# Altium schematic sheet Sheet_1_2023-07-02.schdoc
size 313 x 225 mm
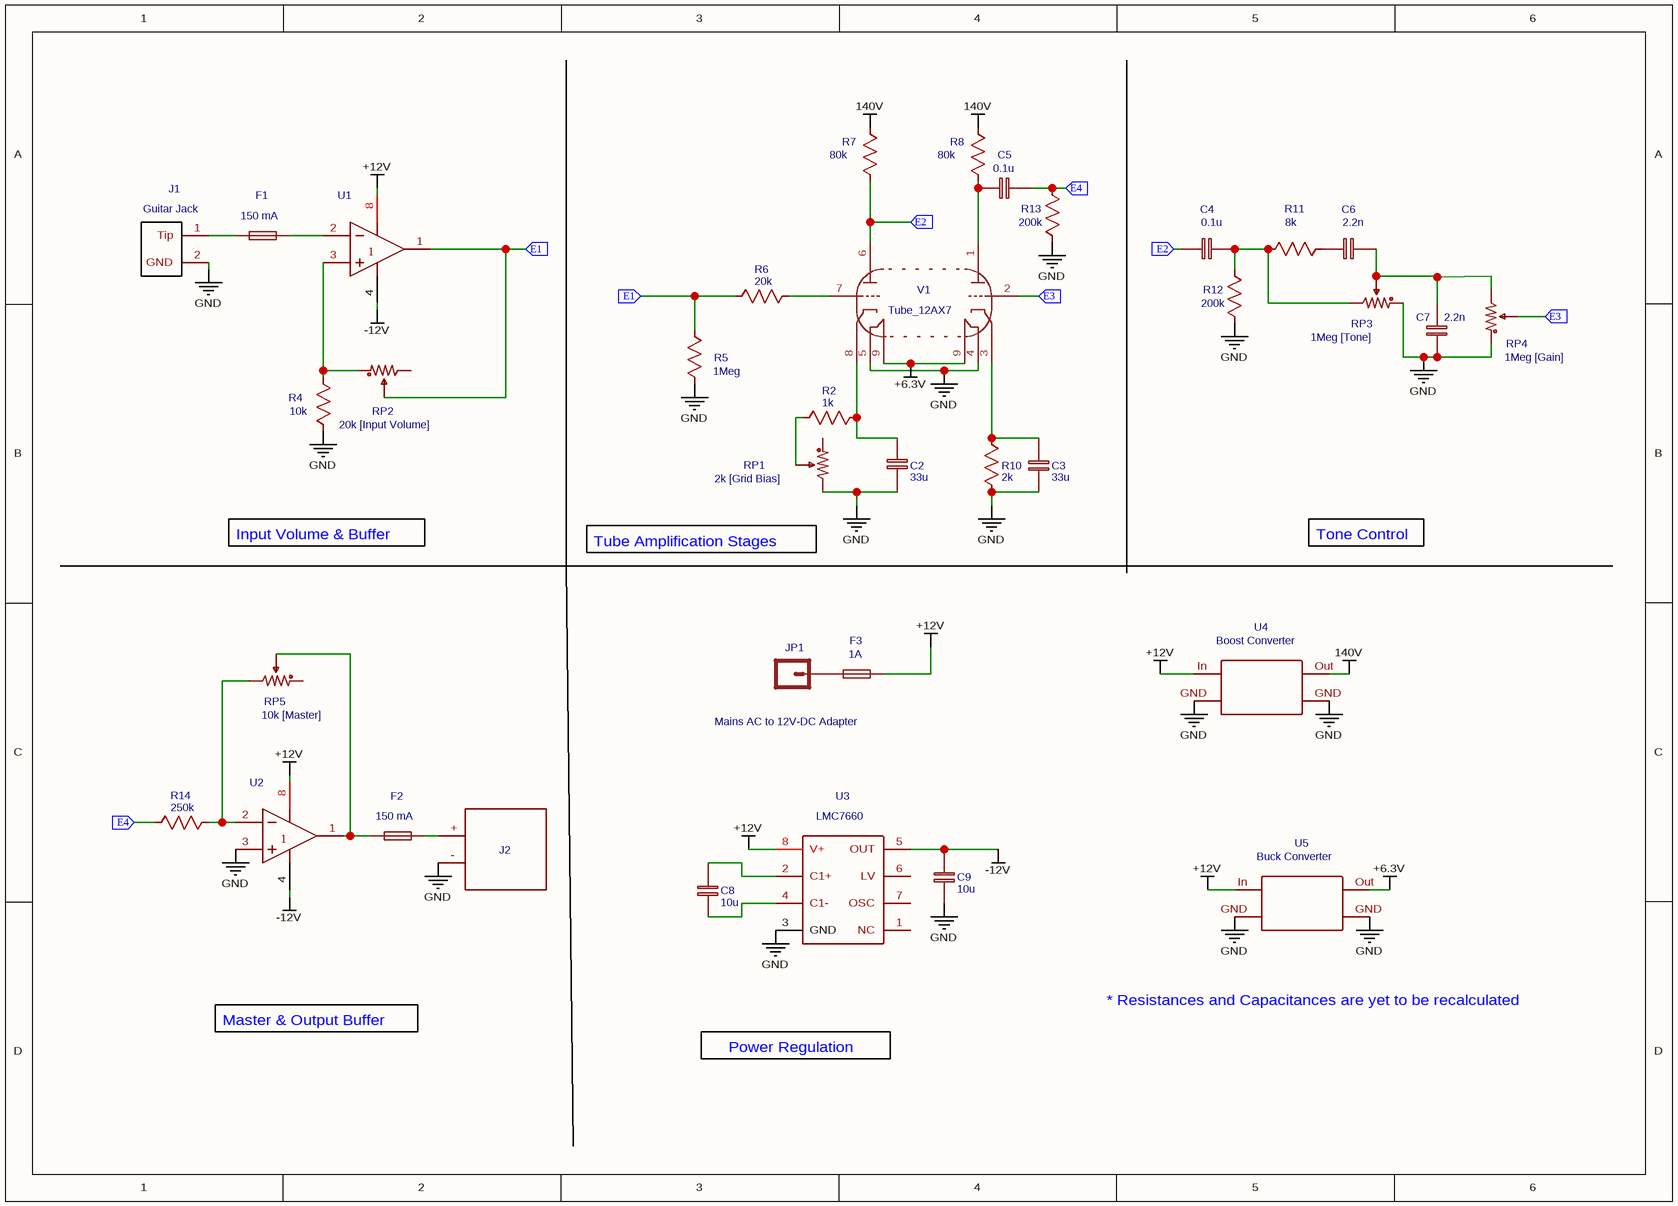
[diagram p0: Sheet_1_2023-07-02.schdoc]

## Parts
C2  33u  [C0603]
C3  33u  [C0603]
C4  0.1u  [C0603]
C5  0.1u  [C0603]
C6  2.2n  [C0603]
C7  2.2n  [C0603]
C8  10u  [C0603]
C9  10u  [C0603]
F1  150 mA  [NANO2_SMF_FUSE]
F2  150 mA  [NANO2_SMF_FUSE]
F3  1A  [NANO2_SMF_FUSE]
J1  Guitar Jack  [GUITAR JACK]
J2  Guitar_Jack_Output  [GUITAR_JACK_OUTPUT]  (value not drawn)
JP1  Mains AC to 12V-DC Adapter  [SPRING-CONNECTOR]
R2  1k  [R0603]
R4  10k  [R0603]
R5  1Meg  [R0603]
R6  20k  [R0603]
R7  80k  [R0603]
R8  80k  [R0603]
R10  2k  [R0603]
R11  8k  [R0603]
R12  200k  [R0603]
R13  200k  [R0603]
R14  250k  [R0603]
RP1  2k [Grid Bias]  [RES-ADJ-TH_3386P]
RP2  20k [Input Volume]  [RES-ADJ-TH_3386P]
RP3  1Meg [Tone]  [RES-ADJ-TH_3386P]
RP4  1Meg [Gain]  [RES-ADJ-TH_3386P]
RP5  10k [Master]  [RES-ADJ-TH_3386P]
U1  HA7-5102-2  [DIP8]  (value not drawn)
U2  HA7-5102-2  [DIP8]  (value not drawn)
U3  LMC7660  [DIP8]
U4  Boost Converter  [SOT-223]
U5  Buck Converter  [SOT-223]
V1  Tube_12AX7  [12AX7]

## Ports
E1 (in), E2 (in), E3 (in), E4 (in)

## Nets
140V: R7.1 R8.1 U4.Out(OUT)
+6.3V: U5.Out(OUT) V1.9(HM)
+12V: F3.2 U1.8(V+) U2.8(V+) U3.8(V+) U4.In(IN) U5.In(IN)
-12V: C9.2 U1.4(V-) U2.4(V-) U3.5(OUT)
GND: C2.2 C3.1 C7.1 C9.1 J1.2(GND) R4.1 R5.1 R10.2 R12.2 R13.2 RP1.3 RP3.1 RP4.1 U2.3(IN+) U3.3(GND) U4.GND(ADJ) U5.GND(ADJ) V1.4(H) V1.5(H)
E1: R5.2 R6.2 RP2.2 U1.1(OUT) ; port E1
E2: C4.1 R7.2 V1.6(PT2) ; port E2
E3: RP4.2 V1.2(GT1) ; port E3
E4: C5.2 R13.1 R14.2 ; port E4
NetC2_1: C2.1 R2.1 V1.8(KT2)
NetC3_2: C3.2 R10.1 V1.3(KT1)
NetC4_2: C4.2 R11.2 R12.1 RP3.3
NetC5_1: C5.1 R8.2 V1.1(PT1)
NetC6_1: C6.1 R11.1
NetC6_2: C6.2 C7.2 RP3.2 RP4.3
NetC8_1: C8.1 U3.4(C1-)
NetC8_2: C8.2 U3.2(C1+)
NetF1_1: F1.1 J1.1(Tip)
NetF1_2: F1.2 U1.2(IN-)
NetF2_1: F2.1 RP5.2 U2.1(OUT)
NetF3_1: F3.1 JP1.P$2
NetR2_2: R2.2 RP1.2
NetR4_2: R4.2 RP2.1 U1.3(IN+)
NetR6_1: R6.1 V1.7(GT2)
NetR14_1: R14.1 RP5.3 U2.2(IN-)

Not connected (* = marked no-connect by the designer): F2 2; J2 +(1) -(2); RP1 1; RP2 3; RP5 1; U3 1(NC) 6(LV) 7(OSC)

## Notes on the sheet
- Input Volume & Buffer
- Tube Amplification Stages
- Tone Control
- Master & Output Buffer
- * Resistances and Capacitances are yet to be recalculated
- Power Regulation
- Labels drawn without touching a wire or pin: GND

## Library data of the parts
C2 C3 = 33u: nameAlias: Value(F); Contributor: LCEDA_Lib; spicePre: C; spiceSymbolName: C_0603_EU
C4 C5 = 0.1u: nameAlias: Value(F); Contributor: LCEDA_Lib; spicePre: C; spiceSymbolName: C_0603_EU
C6 C7 = 2.2n: nameAlias: Value(F); Contributor: LCEDA_Lib; spicePre: C; spiceSymbolName: C_0603_EU
C8 C9 = 10u: nameAlias: Value(F); Contributor: LCEDA_Lib; spicePre: C; spiceSymbolName: C_0603_EU
J1 = Guitar Jack: Contributor: Jose Tovar; spicePre: J; spiceSymbolName: Guitar Jack
J2 = Guitar_Jack_Output: Contributor: ahmits; Package Display: No; spicePre: J; spiceSymbolName: Guitar_Jack_Output
JP1 = Mains AC to 12V-DC Adapter: Contributor: SparkFun; spicePre: J; spiceSymbolName: M01
R2 = 1k: nameAlias: Value(Ω); Contributor: LCEDA_Lib; spicePre: R; spiceSymbolName: R_0603_US
R4 = 10k: nameAlias: Value(Ω); Contributor: LCEDA_Lib; spicePre: R; spiceSymbolName: R_0603_US
R5 = 1Meg: nameAlias: Value(Ω); Contributor: LCEDA_Lib; spicePre: R; spiceSymbolName: R_0603_US
R6 = 20k: nameAlias: Value(Ω); Contributor: LCEDA_Lib; spicePre: R; spiceSymbolName: R_0603_US
R7 R8 = 80k: nameAlias: Value(Ω); Contributor: LCEDA_Lib; spicePre: R; spiceSymbolName: R_0603_US
R10 = 2k: nameAlias: Value(Ω); Contributor: LCEDA_Lib; spicePre: R; spiceSymbolName: R_0603_US
R11 = 8k: nameAlias: Value(Ω); Contributor: LCEDA_Lib; spicePre: R; spiceSymbolName: R_0603_US
R12 R13 = 200k: nameAlias: Value(Ω); Contributor: LCEDA_Lib; spicePre: R; spiceSymbolName: R_0603_US
R14 = 250k: nameAlias: Value(Ω); Contributor: LCEDA_Lib; spicePre: R; spiceSymbolName: R_0603_US
RP1 = 2k [Grid Bias]: nameAlias: Value; Contributor: LCEDA_Lib; BOM_value(Ω): 10K; BOM_Supplier: LCSC; spicePre: R; spiceSymbolName: R_3386P_US
RP2 = 20k [Input Volume]: nameAlias: Value; Contributor: LCEDA_Lib; BOM_value(Ω): 10K; BOM_Supplier: LCSC; spicePre: R; spiceSymbolName: R_3386P_US
RP3 = 1Meg [Tone]: nameAlias: Value; Contributor: LCEDA_Lib; BOM_value(Ω): 10K; BOM_Supplier: LCSC; spicePre: R; spiceSymbolName: R_3386P_US
RP4 = 1Meg [Gain]: nameAlias: Value; Contributor: LCEDA_Lib; BOM_value(Ω): 10K; BOM_Supplier: LCSC; spicePre: R; spiceSymbolName: R_3386P_US
RP5 = 10k [Master]: nameAlias: Value; Contributor: LCEDA_Lib; BOM_Supplier: LCSC; BOM_value(Ω): 10K; spicePre: R; spiceSymbolName: R_3386P_US
U1 U2 = HA7-5102-2: subpart_no: 1; description: Low Noise Operational Amplifier; spicePre: U; spiceSymbolName: HA7-5102-2
U3 = LMC7660: description: Switched Capacitor Voltage Converter, 8-pin MDIP, Pb-Free; spicePre: U; spiceSymbolName: LMC7660INNOPB
U4 = Boost Converter: description: 800mA Low-Dropout Linear Regulator, 4-pin SOT-223, Pb-Free; spicePre: U; spiceSymbolName: LM1117IMPX-ADJNOPB
U5 = Buck Converter: description: 800mA Low-Dropout Linear Regulator, 4-pin SOT-223, Pb-Free; spicePre: U; spiceSymbolName: LM1117IMPX-ADJNOPB
V1 = Tube_12AX7: description: High Mu Dual Triode; Contributor: prvi sedmi; timeStamp: 1459530091; spicePre: V; spiceSymbolName: Tube_12AX7
F1 F2 = 150 mA: spicePre: F; spiceSymbolName: NANO2SMF_R452.500L
F3 = 1A: spicePre: F; spiceSymbolName: NANO2SMF_R452.500L